# EAGLE design i2c-breakout (EAGLE 7.4.0)
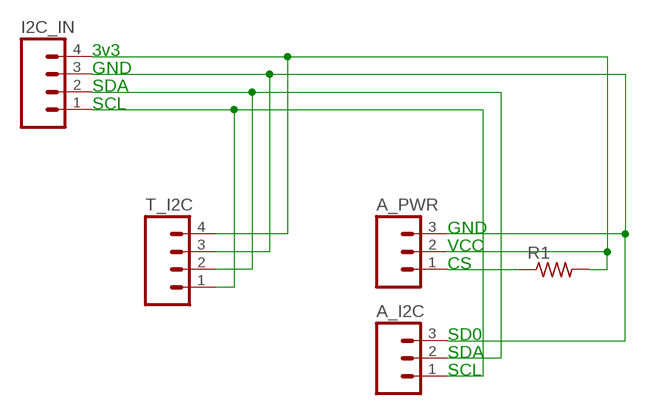
[diagram p0: schematic, sheet 1]

## Parts
A_I2C  M03PTH  [1X03]
A_PWR  M03PTH  [1X03]
I2C_IN  M04PTH  [1X04]
R1  R-US_0207/7  [0207/7]
T_I2C  M04PTH  [1X04]

## Nets
3V3: A_PWR.2 I2C_IN.4 R1.2 T_I2C.4
CS: A_PWR.1 R1.1
GND: A_I2C.3 A_PWR.3 I2C_IN.3 T_I2C.3
SCL: A_I2C.1 I2C_IN.1 T_I2C.1
SDA: A_I2C.2 I2C_IN.2 T_I2C.2

## Notes on the sheet
- 3v3
- GND
- SDA
- SCL
- GND
- VCC
- CS
- SD0
- SDA
- SCL

## Library data of the parts
A_I2C A_PWR = SparkFun-Connectors:M03: Header 3 Standard 3-pin 0.1" header. Use with straight break away headers (SKU : PRT-00116), right angle break away headers (PRT-00553), swiss pins (PRT-00743), machine pins (PRT-00117), and female headers (PRT-00115). Molex polarized connector foot print use with SKU : PRT-08232 with associated crimp pins and housings.
I2C_IN T_I2C = SparkFun-Connectors:M04: Header 4 Standard 4-pin 0.1" header. Use with straight break away headers (SKU : PRT-00116), right angle break away headers (PRT-00553), swiss pins (PRT-00743), machine pins (PRT-00117), and female headers (PRT-00115). Molex polarized connector foot print use with SKU : PRT-08231 with associated crimp pins and housings. 1MM SMD Version SKU: PRT-10208
R1 = resistor:R-US_: RESISTOR, American symbol

## Board
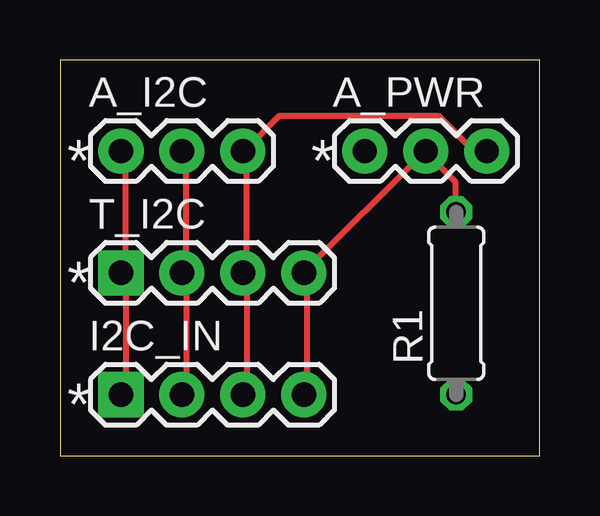
[diagram p1: board, top side]
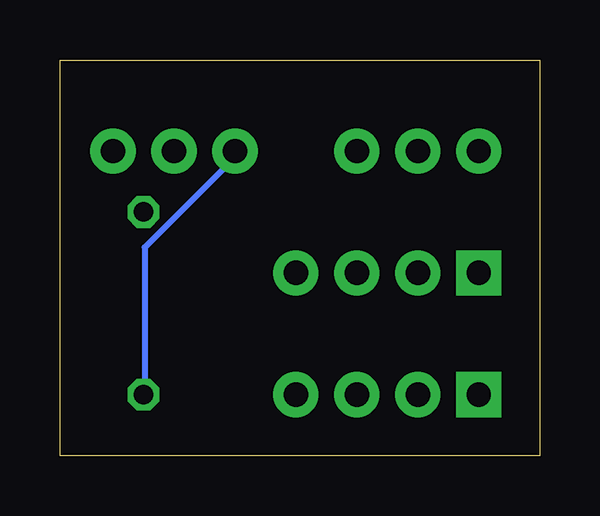
[diagram p2: board, bottom side, seen from below]

Size 19.99 x 16.5 mm. Coordinates in mm from the lower left corner, seen from the top.
Outline: 0,0 19.99,0 19.99,16.5 0,16.5 0,0
Copper layers (1*16): Top 0.035mm / dielectric 1.5mm / Bottom 0.035mm
Design rules "default": minimum track width 10mil, minimum drill 24mil, track to track 8mil, track to pad 8mil, pad to pad 8mil, via to via 8mil, smd to smd 8mil, copper to edge 40mil, drill to drill 8mil, minimum pad ring 10mil, minimum via ring 8mil, stop-mask expansion 4mil, vias tented up to drill 0mil, thermal gap 10mil

### Footprints (pad centres in the part's own frame; a part is rotated, then mirrored left to right if it is on the bottom)
1X03 = drill 1.016 pad 1.88: 1 0,0; 2 2.54,0; 3 5.08,0
1X04 = drill 1.016 pad 1.88 square: 1 0,0 | drill 1.016 pad 1.88: 2 2.54,0; 3 5.08,0; 4 7.62,0
0207/7 = drill 0.813 octagon: 1 -3.81,0; 2 3.81,0

### Placement (x,y rotation side)
A_I2C  2.54,12.7 0 top
A_PWR  12.7,12.7 0 top
I2C_IN  2.54,2.54 0 top
R1  16.51,6.35 90 top
T_I2C  2.54,7.62 0 top

### Tracks (layer width: path | path; a pad name or v marks a point on that pad's centre or on a via)
3V3
  Top 0.254: R1.2 16.46,10.29 16.46,11.43 15.32,12.57 A_PWR.2 15.09,12.57 10.29,7.77 T_I2C.4 10.29,7.54 10.29,2.74 I2C_IN.4
CS
  Bottom 0.254: R1.1 16.46,2.74 16.46,8.69 12.57,12.57 A_PWR.1
GND
  Top 0.254: I2C_IN.3 7.77,2.74 7.77,7.54 T_I2C.3 7.77,7.77 7.77,12.57 A_I2C.3 7.77,12.8 9.14,14.17 15.77,14.17 17.14,12.8 17.6,12.8 A_PWR.3
SCL
  Top 0.254: I2C_IN.1 2.74,2.74 2.74,7.54 T_I2C.1 2.74,7.77 2.74,12.57 A_I2C.1
SDA
  Top 0.254: I2C_IN.2 5.26,2.74 5.26,7.54 T_I2C.2 5.26,7.77 5.26,12.57 A_I2C.2

### Text on the board
tNames: * | * | * | *